# EAGLE design anet-cap-z-probe-esp8266-ext (EAGLE 6.1)
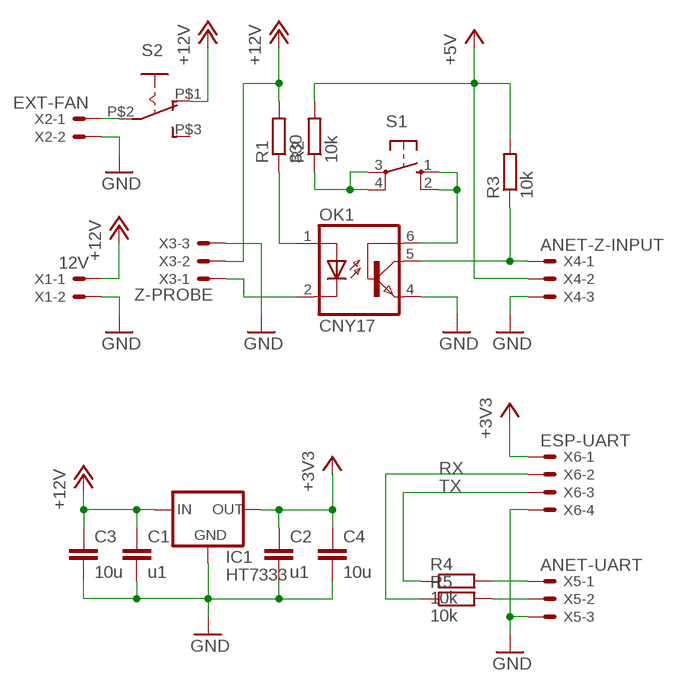
[diagram p0: schematic, sheet 1]

## Parts
C1  u1  C-EU025-025X050  [C025-025X050]
C2  u1  C-EU025-025X050  [C025-025X050]
C3  10u  C-EUC0805K  [C0805K]
C4  10u  C-EUC0805K  [C0805K]
IC1  HT7333  [SOT-89]
OK1  CNY17  [DIL06]
R1  330  R-EU_R0805  [R0805]
R2  10k  R-EU_R0805  [R0805]
R3  10k  R-EU_R0805  [R0805]
R4  10k  R-EU_0204/7  [0204/7]
R5  10k  R-EU_0204/7  [0204/7]
S1  10-XX  [B3F-10XX]
S2  EG1218THIN  [THIN]
X1  12V  JST-XH-02-PIN-LONG-PAD  [JST-XH-02-PACKAGE-LONG-PAD]
X2  EXT-FAN  JST-XH-02-PIN-LONG-PAD  [JST-XH-02-PACKAGE-LONG-PAD]
X3  Z-PROBE  JST-XH-03-PIN-LONG-PAD  [JST-XH-03-PACKAGE-LONG-PAD]
X4  ANET-Z-INPUT  JST-XH-03-PIN-LONG-PAD  [JST-XH-03-PACKAGE-LONG-PAD]
X5  ANET-UART  JST-XH-03-PIN-LONG-PAD  [JST-XH-03-PACKAGE-LONG-PAD]
X6  ESP-UART  JST-XH-04-PIN-LONG-PAD  [JST-XH-04-PACKAGE-LONG-PAD]

## Nets
+3V3: C2.1 C4.1 IC1.1(OUT) X6.1
+5V: R2.2 R3.2 X4.2
+12V: C1.1 C3.1 IC1.3(IN) IC1.4(IN) R1.2 S2.P$1(O) X1.1 X3.2
GND: C1.2 C2.2 C3.2 C4.2 IC1.2(GND) OK1.4(EMI) X1.2 X2.2 X3.3 X4.3 X5.3 X6.4
N$1: S2.P$2(P) X2.1
N$2: OK1.5(COL) R3.1 X4.1
N$4: R2.1 S1.3(P) S1.4(P1)
N$5: OK1.6(BAS) S1.1(S) S1.2(S1)
N$6: OK1.1(A) R1.1
N$7: OK1.2(C) X3.1
N$10: R4.2 X5.1
N$11: R5.2 X5.2
RX: R5.1 X6.2
TX: R4.1 X6.3
Unconnected: S2.P$3(S)

## Library data of the parts
C1-C4 = rcl:C-EU: CAPACITOR, European symbol
IC1 = holtek2:HT73*
OK1 = optocoupler:CNY17: SIEMENS OPTO COUPLER; MPN: CNY17-1; OC_FARNELL: 1045399; OC_NEWARK: 05M4044
R1-R5 = rcl:R-EU_: RESISTOR, European symbol
S1 = switch-omron:10-XX: OMRON SWITCH; MPN: B3F-1000; OC_FARNELL: 176432; OC_NEWARK: 36M3542
S2 = _MY_OWN_LIB:EG1218: SLIDING SWITCH 0.1" spacing through hole, vertical SPDT slide switch http://www.ladyada.net/library/pcb/eaglelibrary.html
X1 X2 = Rembrandt Electronics - JST XH Connectors v1-0:JST-XH-02-PIN: JST XH Connector 2 Pin Wire to board connector. Pitch: 2,54 mm, (0.100") Number of pins: 2 Created by Rembrandt Electronics www.rembrandtelectronics.com
X3-X5 = Rembrandt Electronics - JST XH Connectors v1-0:JST-XH-03-PIN: JST XH Connector 2 Pin Wire to board connector. Pitch: 2,54 mm, (0.100") Number of pins: 3 Created by Rembrandt Electronics www.rembrandtelectronics.com
X6 = Rembrandt Electronics - JST XH Connectors v1-0:JST-XH-04-PIN: JST XH Connector 2 Pin Wire to board connector. Pitch: 2,54 mm, (0.100") Number of pins: 4 Created by Rembrandt Electronics www.rembrandtelectronics.com

## Board
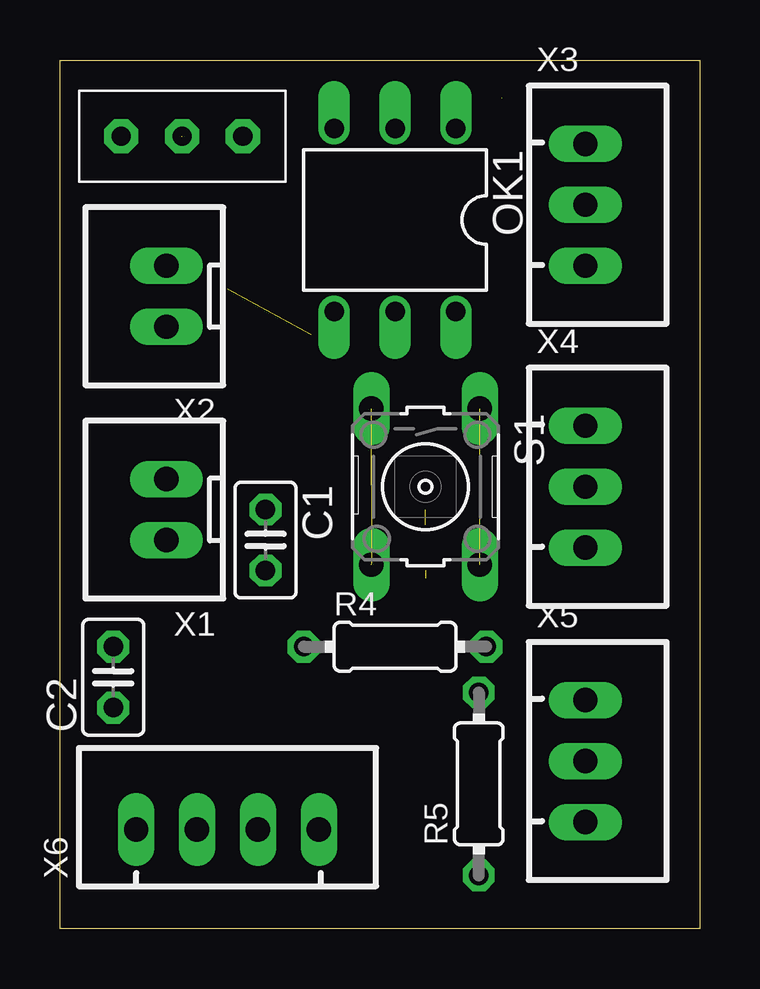
[diagram p1: board, top side]
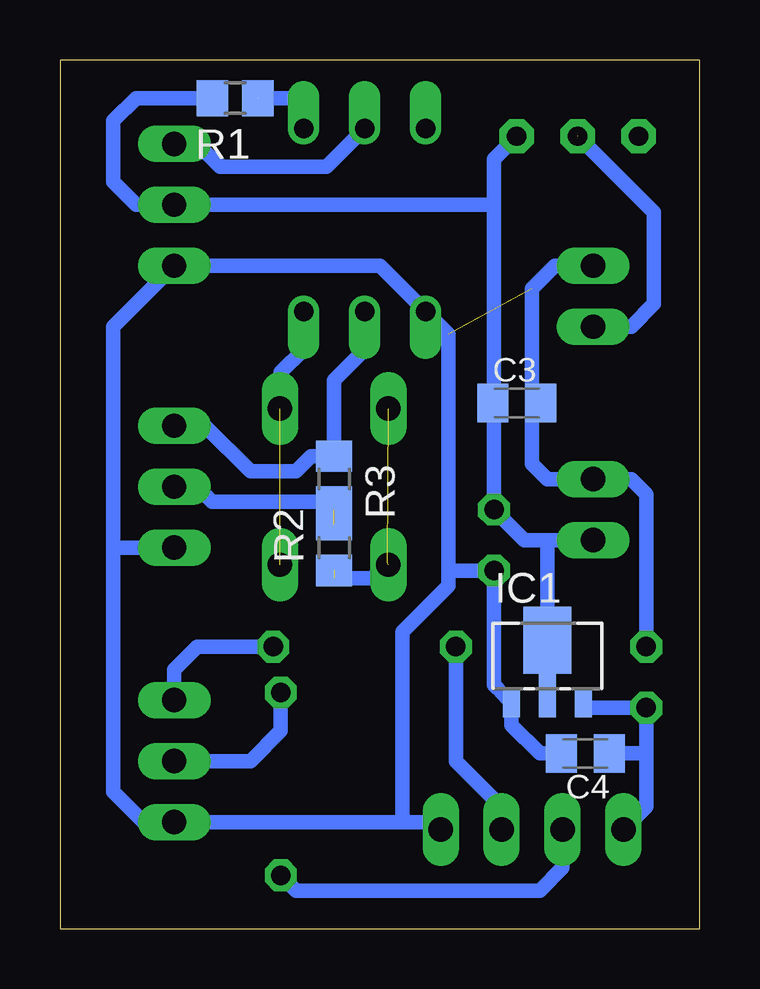
[diagram p2: board, bottom side, seen from below]

Size 26.67 x 36.2 mm. Coordinates in mm from the lower left corner, seen from the top.
Outline: 0,0 0,36.2 26.67,36.2 26.67,0 0,0
Copper layers (1*16): Top 0.035mm / dielectric 1.5mm / Bottom 0.035mm
Design rules: minimum track width 10mil, minimum drill 24mil, track to track 12mil, track to pad 12mil, pad to pad 12mil, via to via 12mil, smd to smd 10mil, copper to edge 12mil, drill to drill 12mil, minimum pad ring 10mil, minimum via ring 10mil, stop-mask expansion 4mil, vias tented up to drill 0mil, thermal gap 12mil

### Footprints (pad centres in the part's own frame; a part is rotated, then mirrored left to right if it is on the bottom)
C025-025X050 = drill 0.813 octagon: 1 -1.27,0; 2 1.27,0
C0805K = smd 1.3 x 1.6: 1 -1,0; 2 1,0
SOT-89 = smd 0.7 x 1.1: 1 1.5,-2.385; 2 -1.5,-2.385 | smd 0.7 x 1.8: 3 0,-2.035 | smd 2 x 2.8: 4 0,0.265
DIL06 = drill 0.813 offset: 1 -2.54,-3.81; 2 0,-3.81; 3 2.54,-3.81; 4 2.54,3.81; 5 0,3.81; 6 -2.54,3.81
R0805 = smd 1.3 x 1.5: 1 -0.95,0; 2 0.95,0
0204/7 = drill 0.813 octagon: 1 -3.81,0; 2 3.81,0
B3F-10XX = drill 1.016 long: 1 -3.251,2.261; 2 3.251,2.261; 3 -3.251,-2.261; 4 3.251,-2.261
THIN = drill 0.8 pad 1.422 octagon: P$1 -2.548,-0.002; P$2 -0.008,-0.002; P$3 2.532,-0.002
JST-XH-02-PACKAGE-LONG-PAD = drill 1.016 long: 1 -1.27,0; 2 1.27,0
JST-XH-03-PACKAGE-LONG-PAD = drill 1.016 long: 1 -2.54,0; 2 0,0; 3 2.54,0
JST-XH-04-PACKAGE-LONG-PAD = drill 1.016 long: 1 -3.81,0; 2 -1.27,0; 3 1.27,0; 4 3.81,0

### Placement (x,y rotation side)
C1  8.57,16.19 270 top
C2  2.22,10.48 90 top
C3  7.62,21.91 0 bottom
C4  4.76,7.3 180 bottom
IC1  6.35,11.75 0 bottom
OK1  13.97,29.53 180 top
R1  19.37,34.61 180 bottom
R2  15.24,15.88 90 bottom
R3  15.24,18.73 270 bottom
R4  13.97,11.75 0 top
R5  17.46,6.03 90 top
S1  15.24,18.41 270 top
S2  5.08,33.02 180 top
X1  4.45,17.46 90 top
X2  4.45,26.35 90 top
X3  21.91,30.16 270 top
X4  21.91,18.41 270 top
X5  21.91,6.98 270 top
X6  6.98,4.13 0 top

### Tracks (layer width: path | path; a pad name or v marks a point on that pad's centre or on a via)
+3V3
  Bottom 0.61: X6.1 2.22,5.08 2.22,7.3 | 2.22,7.3 C2.1 4.76,9.21 4.85,9.29 IC1.1 | C4.1 2.22,7.3
+5V  (1 unrouted)
  Bottom 0.61: R3.2 | 15.24,17.46 R3.2 | R3.2 20.32,17.78 20.95,18.41 X4.2
+12V
  Bottom 0.61: R1.2 23.5,34.61 24.45,33.66 24.45,31.11 23.5,30.16 X3.2 8.57,30.16 | S2.P$1 8.57,32.07 8.57,30.16 | 8.57,30.16 8.57,21.91 | 8.57,21.91 C1.1 7.3,16.19 6.35,16.19 | X1.1 6.35,16.19 | IC1.3 IC1.4 6.35,16.19 | C3.1 8.57,21.91
GND  (1 unrouted)
  Bottom 0.61: X4.3 24.45,15.88 | 24.45,15.88 24.45,25.08 X3.3 13.33,27.62 OK1.4 10.48,24.77 10.48,14.92 | 6.98,21.91 6.98,26.67 6.03,27.62 X2.2 | 10.48,14.92 10.48,14.29 12.38,12.38 12.38,4.44 | 24.45,15.88 24.45,5.71 23.18,4.44 X5.3 12.38,4.44 | 12.38,4.44 11.11,4.44 X6.4 | C3.2 6.98,21.91 | 6.98,21.91 6.98,19.37 6.35,18.73 X1.2 2.86,18.73 2.22,18.1 C2.2 | 10.48,14.92 C1.2 8.57,10.16 8.41,10 IC1.2 7.85,8.48 6.67,7.3 C4.2
N$1  (1 unrouted)
  Bottom 0.61: X2.1 2.86,25.08 1.91,26.04 1.91,29.84 S2.P$2
N$2
  Bottom 0.61: OK1.5 13.97,24.13 15.24,22.86 R3.1 16.2,19.68 16.83,19.05 18.73,19.05 20.64,20.95 X4.1
N$4  (3 unrouted)
  Bottom 0.61: 15.24,14.61 13.65,14.61 13.02,15.24
N$5  (1 unrouted)
  Bottom 0.61: OK1.6 16.51,24.13 17.46,23.18 17.46,21.7 S1.1
N$6  (1 unrouted)
  Bottom 0.61: OK1.1 16.51,34.61 R1.1
N$7
  Bottom 0.61: X3.1 20.95,32.7 20,31.75 15.56,31.75 OK1.2
N$10
  Bottom 0.61: R4.2 20.95,11.75 21.91,10.79 X5.1
N$11
  Bottom 0.61: R5.2 17.46,8.25 18.73,6.98 X5.2
RX
  Bottom 0.61: X6.2 5.71,2.54 6.67,1.59 16.83,1.59 R5.1
TX
  Bottom 0.61: X6.3 8.26,5.08 10.16,6.98 R4.1